# Altium schematic sheet Alim_Ticketing_Master.SchDoc
size A4; Author: Mario Dos Santos; Organization: ETML-ES; Address1: Avenue Recordon 1; Address2: 1004 Lausanne; Address3: Switzerland; Revision: C; SheetNumber: 2; SheetTotal: 6
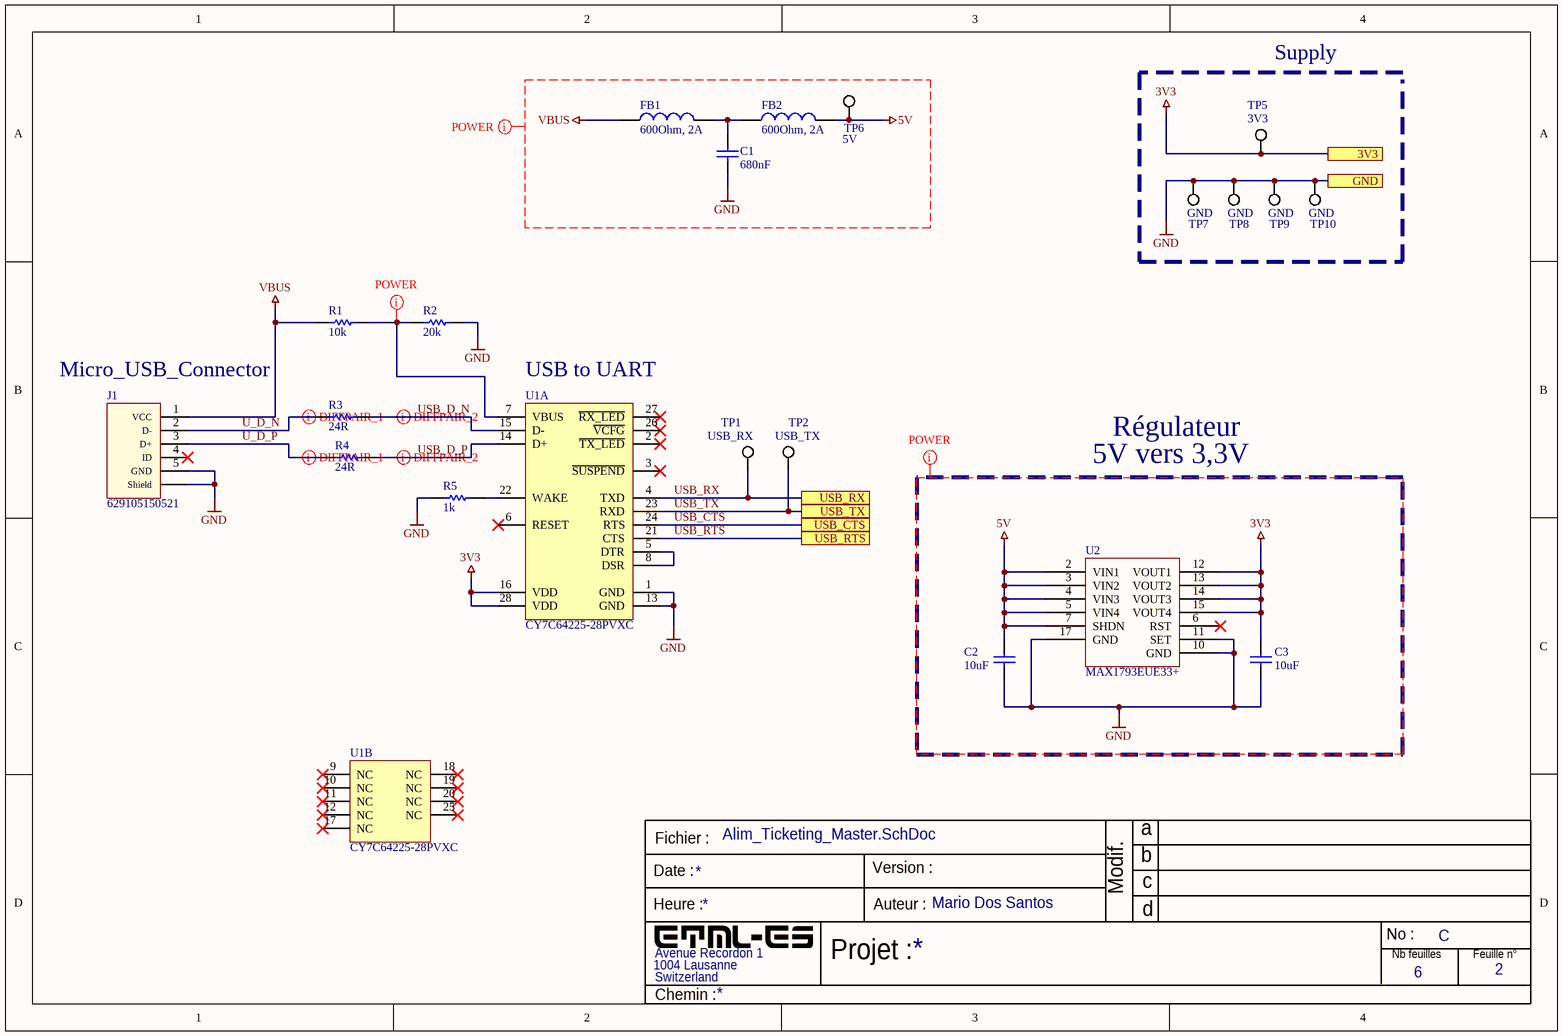
[diagram p0: Alim_Ticketing_Master.SchDoc]

## Parts
C1  680nF  [6-0805_N]
C2  10uF  [6-0805_N]
C3  10uF  [6-0805_N]
FB1  600Ohm, 2A  [WE-CBF_0805_High Current]
FB2  600Ohm, 2A  [WE-CBF_0805_High Current]
J1  629105150521  [629105150521]
R1  10k  [RESC0805(2012)_L]
R2  20k  [RESC0805(2012)_L]
R3  24R  [RESC0805(2012)_L]
R4  24R  [RESC0805(2012)_L]
R5  1k  [RESC0805(2012)_L]
TP1  (no value)  [KSTN-5019_V]
TP2  (no value)  [KSTN-5019_V]
TP5  (no value)  [KSTN-5019_V]
TP6  (no value)  [KSTN-5019_V]
TP7  (no value)  [KSTN-5019_V]
TP8  (no value)  [KSTN-5019_V]
TP9  (no value)  [KSTN-5019_V]
TP10  (no value)  [KSTN-5019_V]
U1  CY7C64225-28PVXC  [CYP-PVX28_N]  (parts A,B of 2)
U2  MAX1793EUE33+  [TSOP65P640X110_HS-17N]

## Blocks framed on the sheet
5V vers 3,3V: C2 C3 U2

## Ports
3V3, GND, USB_CTS, USB_RTS, USB_RX, USB_TX

## Nets
3V3: C3.2 TP5.1 U1.16(VDD) U1.28(VDD) U2.12(VOUT1) U2.13(VOUT2) U2.14(VOUT3) U2.15(VOUT4) ; port 3V3
5V: C2.1 FB2.2 TP6.1 U2.2(VIN1) U2.3(VIN2) U2.4(VIN3) U2.5(VIN4) U2.7(SHDN)
GND: C1.2 C2.2 C3.1 J1.5(GND) J1.Shell(Shield) R2.2 R5.2 TP7.1 TP8.1 TP9.1 TP10.1 U1.1(GND) U1.13(GND) U2.10(GND) U2.11(SET) U2.17(GND) ; port GND
VBUS: FB1.1 J1.1(VCC) R1.1
U_D_N: J1.2(D-) R3.1
U_D_P: J1.3(D+) R4.1
USB_CTS: U1.24(RTS) ; port USB_CTS
USB_D_N: R3.2 U1.15(D-)
USB_D_P: R4.2 U1.14(D+)
USB_RTS: U1.21(CTS) ; port USB_RTS
USB_RX: TP1.1 U1.4(TXD) ; port USB_RX
USB_TX: TP2.1 U1.23(RXD) ; port USB_TX
NetC1_1: C1.1 FB1.2 FB2.1
NetR1_2: R1.2 R2.1 U1.7(VBUS)
NetR5_1: R5.1 U1.22(WAKE)
NetU1_5: U1.5(DTR) U1.8(DSR)

Not connected (* = marked no-connect by the designer): J1 4(ID)*; U1 2(~{TX_LED})* 3(~{SUSPEND})* 6(RESET)* 9(NC)* 10(NC)* 11(NC)* 12(NC)* 17(NC)* 18(NC)* 19(NC)* 20(NC)* 25(NC)* 26(~{VCFG})* 27(~{RX_LED})*; U2 6(RST)*

## Layout directives
differential pair: U_D_N, U_D_P, USB_D_N, USB_D_P
net class POWER: 3V3, 5V, GND, NetR1_2, VBUS

## Notes on the sheet
- Supply
- 5V
- (near TP5) 3V3
- (near TP7) GND
- (near TP8) GND
- (near TP9) GND
- (near TP10) GND
- (near J1) Micro_USB_Connector
- (near U1) USB to UART
- (near TP1) USB_RX
- (near TP2) USB_TX
- Régulateur
- Fichier :
- a
- Date :
- Heure :
- Version :
- Auteur :
- Modif.
- b
- c
- d
- Projet :
- No :
- Nb feuilles
- Feuille n°
- Chemin :

## Library data of the parts
C1 = 885012207098: WCAP-CSGP General Purpose Ceramic Capacitors, size 0805, 100nF, +/-10%, 50VDC; Technical Reference: X7R0805104K050DFCT10000; Capacitance: 680nF; Supplier Part Number 1: 732-7663-1-ND; Value: 680nF; Supplier unit price: 0.13; Supplier: Digi-Key; Supplier Part Number: 732-7663-1-ND
C2 C3 = Cap: Capacitor; Published: 8-Jun-2000; LatestRevisionDate: 17-Jul-2002; LatestRevisionNote: Re-released for DXP Platform.; PackageReference: RAD-0.3; Publisher: Altium Limited; PackageDescription: Radial Cap, Thru-Hole; 2 Leads; 0.3 in Pin Spacing; Value: 10uF; Capacitance: 10uF; Supplier Part Number: 1276-1298-1-ND; Supplier unit price: 0.1; Supplier: Digi-Key
FB1 FB2 = 742792040: WE-CBF SMT EMI Suppression Ferrite Bead, size 0805, 600Ohm, 2A; Impedance max.: 700Ohm; DC Resistance max.: 0.15Ohm; Type: High Current; ComponentLink1Description: Manufacturer; ComponentLink1URL: http://www.we-online.de; ComponentLink2Description: Datasheet; ComponentLink2URL: https://katalog.we-online.com/pbs/datasheet/742792040.pdf; Part Number: 742792040; Published Date: March 2019; Publisher: Wurth Elektronik; Rated Current: 2A; Operating Temperature: -55 to +125degC; Impedance@100 MHz: 600Ohm; Mounting Technology: SMT; Packaging: Tape and Reel; Size: 0805; Supplier Part Number 1: 732-1620-1-ND; Supplier unit price: 0.22; Supplier: Digi-Key; Value: 600Ohm, 2A; Supplier Part Number: 732-1620-1-ND
J1 = 629105150521: Micro USB 2.0 SMT Type B Horizontal 5 Contacts High Current WR-COM; Part Number: 732-5960-1-ND; Interface Type: Type B; Gender: Receptacle; ComponentLink1Description: Manufacturer; ComponentLink1URL: http://www.we-online.de; ComponentLink2Description: Datasheet; ComponentLink2URL: http://katalog.we-online.de/em/datasheet/629105150521.pdf; Published Date: April 2017; Publisher: Wurth Elektronik; Sub-Family: Micro USB 2.0; Type: Horizontal; Construction: SMT; Value: 629105150521; Supplier: Digi-key; Supplier Part Number: 732-5960-1-ND; Supplier unit price: 2.12
R1-R5 = CMP-1013-00122-1: 100K 0.125W 5% 0805 (2012 Metric)  SMD; Case-Metric: 2012; Case-EIA: 0805; Tolerance: 5 %; Technology: SMT; Power: 0.125 W; Supplier: Digi-Key; Supplier unit price: 0.1
  R1: Value: 10k; Supplier Part Number: 311-10KLGCT-ND
  R2: Value: 20k; Supplier Part Number: RNCP0805FTD20K0CT-ND
  R3 R4: Value: 24R; Supplier Part Number: 311-24.0CRCT-ND
  R5: Value: 1k; Supplier Part Number: RNCP0805FTD1K00CT-ND
TP1 TP2 TP5-TP10 = CMP-1672-00008-1: Test Point, 1 Position SMD, RoHS, Tape and Reel; ComponentLink1Description: Manufacturer URL; Package Quantity: 1000; DatasheetVersion: 03/2014; Packaging: Tape and Reel; ComponentLink2URL: http://www.keyelco.com/product-pdf.cfm?p=1357; ComponentLink1URL: http://www.keyelco.com/; Mount: Surface Mount; Contact Plating: Silver; PackageDescription: 1-Pin Surface Mount Device, Body 3.81 x 2.03 mm; Pins: 1; RoHSCompliant: True; Mounting Technology: Surface Mount; ComponentLink2Description: Datasheet; PackageReference: 5019; Supplier: Digi-Key; Supplier Part Number: 36-5019CT-ND; Supplier unit price: 0.33
U1 = CMP-0967-00143-1: USB-to-UART Bridge Controller, 3 to 5.25 V, 0 to 70 degC, 28-Pin SSOP (PVX28), Tube; Manufacturer: Cypress; Part Number: 428-3158-ND; Max. Operating Voltage (V): 5.25; Min. Operating Voltage (V): 3; Memory Architecture: Flash; Mounting Technology: Surface Mount; Max. Operating Temp. (degreesC): 70; DatasheetVersion: Rev. *D; Packing: Tube; ComponentLink2URL: http://www.cypress.com/?docID=48153; PackageReference: PVX28; PartNumber: CY7C64225-28PVXC; PackageDescription: 28-Pin Super Small Outline Package, Body 10.2 x 5.3 mm, Pitch 0.65 mm; RoHS: Pb-Free; ComponentLink3Description: Package Specification; Min. Operating Temp. (degreesC): 0; ComponentLink1URL: http://www.cypress.com/; ComponentLink2Description: Datasheet; ComponentLink1Description: Manufacturer URL; PackageVersion: Rev. *C, 10/2001; ComponentLink3URL: http://www.cypress.com/?docID=1371; Manufacturer Part Number: CY7C64225-28PVXC; Value: CY7C64225-28PVXC; Supplier: Digi-key; Supplier Part Number: 428-3158-ND; Supplier unit price: 3.83
U2 = MAX1793: Supplier Part Number: MAX1793EUE33+-ND; Supplier unit price: 3.92; Value: MAX1793EUE33+; Supplier: Digi-Key